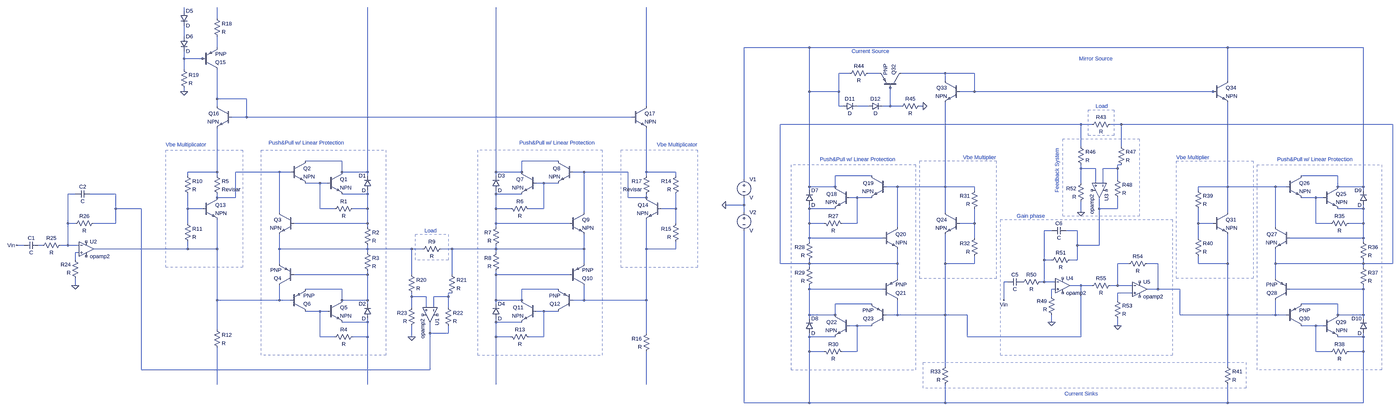
[diagram p0: schematic V1.asc, whole sheet]
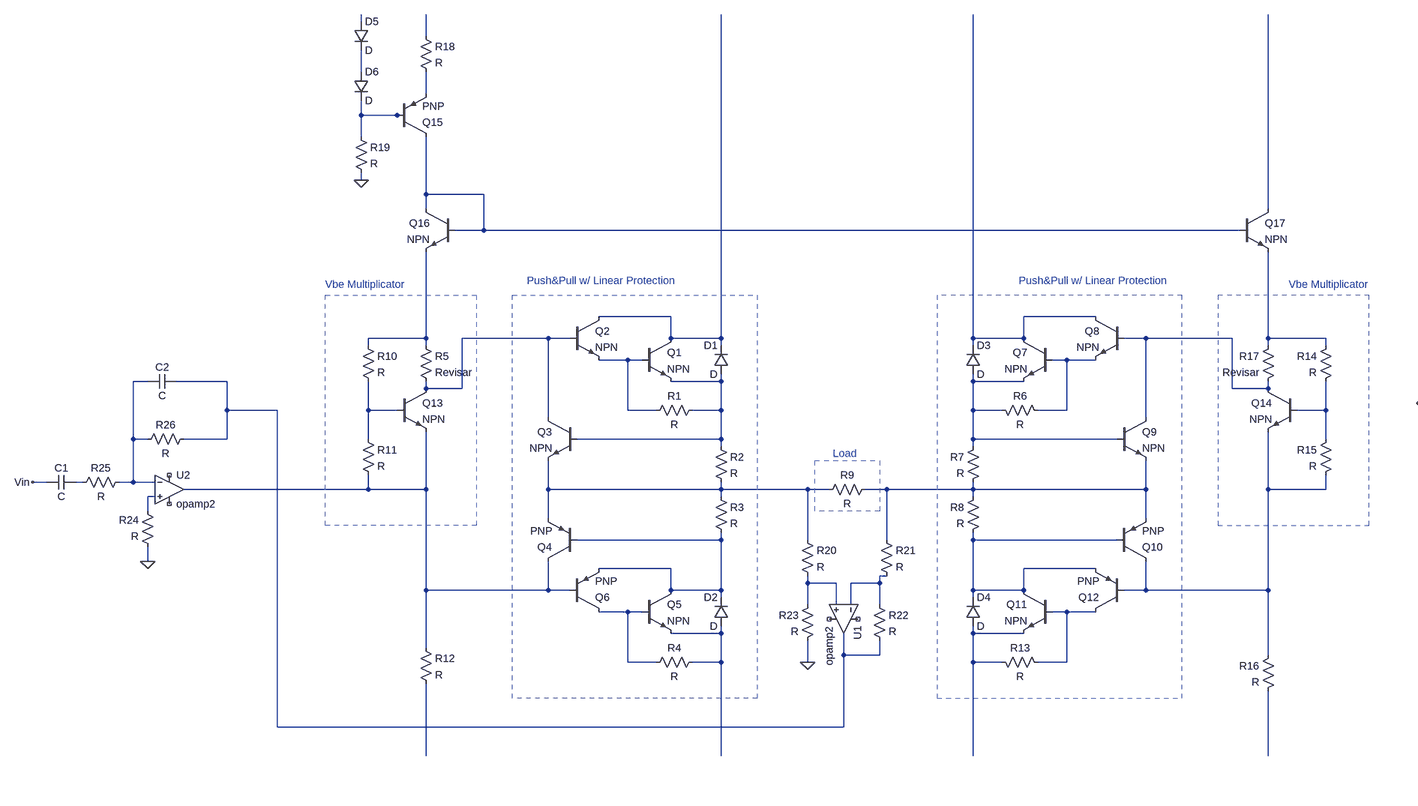
[diagram p1: schematic V1.asc, part, row 1 of 1, column 1 of 2]
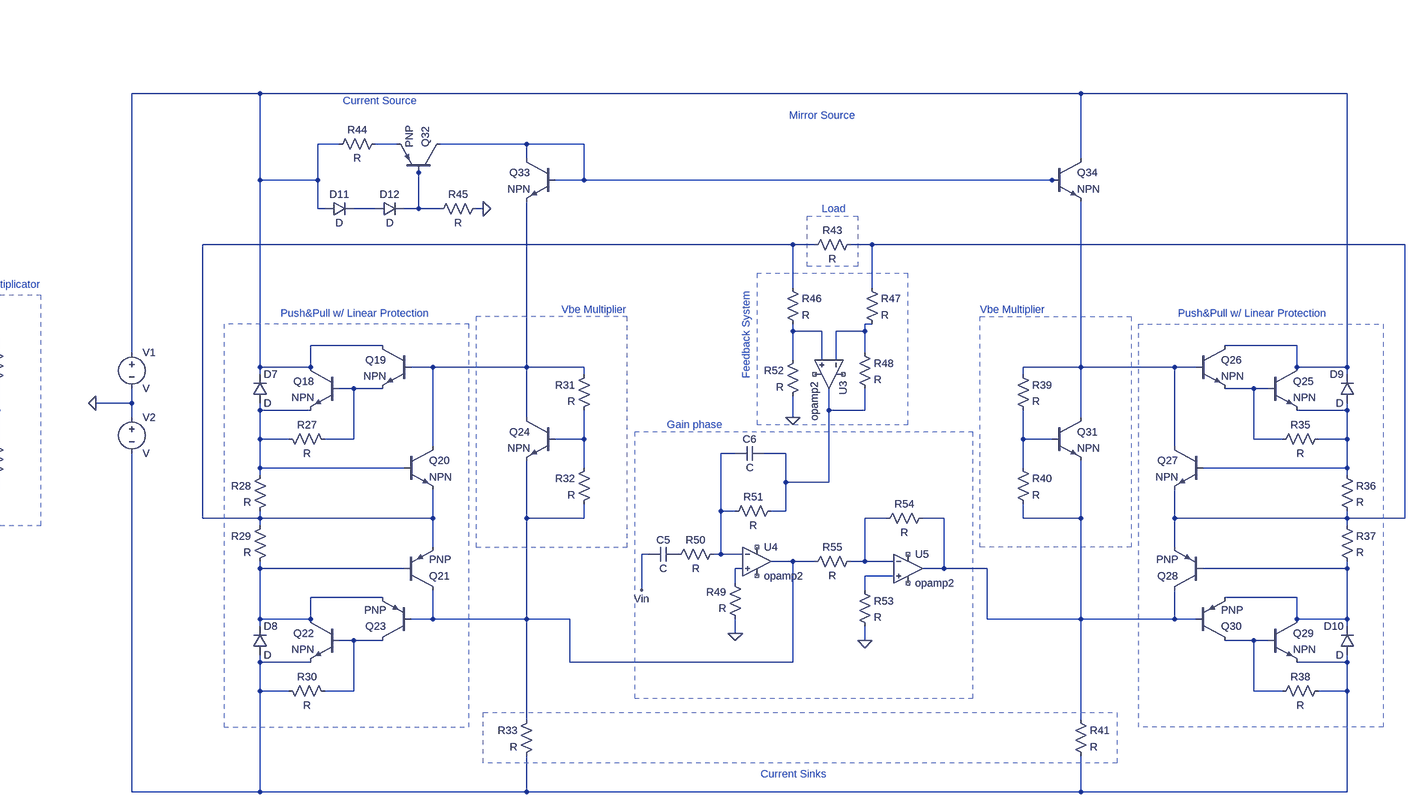
[diagram p2: schematic V1.asc, part, row 1 of 1, column 2 of 2]
V1.asc, the LTspice schematic file:
Version 4
SHEET 1 5492 2148
WIRE -528 -672 -528 -688
WIRE -384 -640 -384 -688
WIRE -528 -560 -528 -608
WIRE -384 -512 -384 -560
WIRE 2672 -512 2352 -512
WIRE 4496 -512 2672 -512
WIRE 5088 -512 4496 -512
WIRE -528 -464 -528 -496
WIRE -448 -464 -528 -464
WIRE -432 -464 -448 -464
WIRE -528 -416 -528 -464
WIRE 2848 -400 2800 -400
WIRE 2976 -400 2928 -400
WIRE 3264 -400 3072 -400
WIRE 3392 -400 3264 -400
WIRE 3264 -368 3264 -400
WIRE 4496 -368 4496 -512
WIRE 3024 -336 3024 -352
WIRE -528 -320 -528 -336
WIRE 2672 -320 2672 -512
WIRE 2800 -320 2800 -400
WIRE 2800 -320 2672 -320
WIRE 3392 -320 3392 -400
WIRE 3392 -320 3328 -320
WIRE 4432 -320 3392 -320
WIRE 4448 -320 4432 -320
WIRE -384 -288 -384 -416
WIRE -256 -288 -384 -288
WIRE -384 -256 -384 -288
WIRE 1488 -256 1488 -688
WIRE 2800 -256 2800 -320
WIRE 2816 -256 2800 -256
WIRE 2928 -256 2880 -256
WIRE 3024 -256 3024 -336
WIRE 3024 -256 2992 -256
WIRE 3072 -256 3024 -256
WIRE 3168 -256 3152 -256
WIRE -256 -208 -256 -288
WIRE -256 -208 -320 -208
WIRE 1424 -208 -256 -208
WIRE 3856 -176 2544 -176
WIRE 3904 -176 3856 -176
WIRE 4032 -176 3984 -176
WIRE 5216 -176 4032 -176
WIRE 3856 -80 3856 -176
WIRE 4032 -80 4032 -176
WIRE 160 -16 0 -16
WIRE 1104 -16 944 -16
WIRE 4032 0 4016 0
WIRE 3856 16 3856 0
WIRE 3920 16 3856 16
WIRE 4016 16 4016 0
WIRE 4016 16 3952 16
WIRE -384 32 -384 -160
WIRE -384 32 -512 32
WIRE -112 32 -304 32
WIRE -64 32 -112 32
WIRE 160 32 160 -16
WIRE 272 32 272 -688
WIRE 272 32 160 32
WIRE 832 32 832 -688
WIRE 944 32 944 -16
WIRE 944 32 832 32
WIRE 1216 32 1168 32
WIRE 1408 32 1216 32
WIRE 1488 32 1488 -160
WIRE 1616 32 1488 32
WIRE -512 48 -512 32
WIRE -384 48 -384 32
WIRE 272 48 272 32
WIRE 832 48 832 32
WIRE 1488 48 1488 32
WIRE 1616 48 1616 32
WIRE 2944 48 2784 48
WIRE 4976 48 4816 48
WIRE 2352 64 2352 -512
WIRE 4016 64 4016 16
WIRE 64 80 0 80
WIRE 96 80 64 80
WIRE 1040 80 1008 80
WIRE 1104 80 1040 80
WIRE 3856 80 3856 16
WIRE 3920 80 3920 16
WIRE 3952 80 3952 16
WIRE 2672 96 2672 -320
WIRE 2784 96 2784 48
WIRE 2784 96 2672 96
WIRE 3056 96 3008 96
WIRE 3264 96 3264 -272
WIRE 3264 96 3056 96
WIRE 3392 96 3264 96
WIRE 4496 96 4496 -272
WIRE 4496 96 4368 96
WIRE 4704 96 4496 96
WIRE 4752 96 4704 96
WIRE 4976 96 4976 48
WIRE 5088 96 5088 -512
WIRE 5088 96 4976 96
WIRE 2672 112 2672 96
WIRE 3392 112 3392 96
WIRE 4368 112 4368 96
WIRE 5088 112 5088 96
WIRE -1216 128 -1248 128
WIRE -1040 128 -1152 128
WIRE 272 128 272 112
WIRE 272 128 160 128
WIRE 832 128 832 112
WIRE 944 128 832 128
WIRE -384 144 -384 128
WIRE -304 144 -304 32
WIRE -304 144 -384 144
WIRE 1408 144 1408 32
WIRE 1488 144 1488 128
WIRE 1488 144 1408 144
WIRE 2880 144 2848 144
WIRE 2944 144 2880 144
WIRE 4880 144 4816 144
WIRE 4912 144 4880 144
WIRE 2352 176 2352 144
WIRE 2352 176 2272 176
WIRE -1040 192 -1040 128
WIRE -768 192 -1040 192
WIRE -512 192 -512 128
WIRE -448 192 -512 192
WIRE 64 192 64 80
WIRE 128 192 64 192
WIRE 272 192 272 128
WIRE 272 192 208 192
WIRE 832 192 832 128
WIRE 896 192 832 192
WIRE 1040 192 1040 80
WIRE 1040 192 976 192
WIRE 1616 192 1616 128
WIRE 1616 192 1552 192
WIRE 2672 192 2672 176
WIRE 2784 192 2672 192
WIRE 3936 192 3936 144
WIRE 4016 192 4016 144
WIRE 4016 192 3936 192
WIRE 5088 192 5088 176
WIRE 5088 192 4976 192
WIRE -112 208 -112 32
WIRE 1216 208 1216 32
WIRE 2352 208 2352 176
WIRE 3264 208 3264 96
WIRE 3856 208 3856 160
WIRE 4496 208 4496 96
WIRE -1248 256 -1248 128
WIRE -1216 256 -1248 256
WIRE -1040 256 -1040 192
WIRE -1040 256 -1136 256
WIRE -512 256 -512 192
WIRE 272 256 272 192
WIRE 272 256 -48 256
WIRE 832 256 832 192
WIRE 1152 256 832 256
WIRE 1616 256 1616 192
WIRE 2672 256 2672 192
WIRE 2736 256 2672 256
WIRE 2880 256 2880 144
WIRE 2880 256 2816 256
WIRE 3392 256 3392 192
WIRE 3392 256 3328 256
WIRE 4368 256 4368 192
WIRE 4432 256 4368 256
WIRE 4880 256 4880 144
WIRE 4944 256 4880 256
WIRE 5088 256 5088 192
WIRE 5088 256 5024 256
WIRE 272 272 272 256
WIRE 832 272 832 256
WIRE 3056 272 3056 96
WIRE 4704 272 4704 96
WIRE 3728 288 3696 288
WIRE 3840 288 3792 288
WIRE 2672 320 2672 256
WIRE 2992 320 2672 320
WIRE 3392 320 3392 256
WIRE 4368 320 4368 256
WIRE 5088 320 5088 256
WIRE 5088 320 4768 320
WIRE 2672 336 2672 320
WIRE 5088 336 5088 320
WIRE -1440 352 -1472 352
WIRE -1360 352 -1376 352
WIRE -1248 352 -1248 256
WIRE -1248 352 -1280 352
WIRE -1200 352 -1248 352
WIRE 3840 352 3840 288
WIRE 3936 352 3936 192
WIRE 3936 352 3840 352
WIRE -512 368 -512 336
WIRE -512 368 -1136 368
WIRE -384 368 -384 240
WIRE -384 368 -512 368
WIRE -112 368 -112 304
WIRE 272 368 272 352
WIRE 272 368 -112 368
WIRE 464 368 272 368
WIRE 512 368 464 368
WIRE 640 368 592 368
WIRE 832 368 832 352
WIRE 832 368 640 368
WIRE 1216 368 1216 304
WIRE 1216 368 832 368
WIRE 1488 368 1488 240
WIRE 1616 368 1616 336
WIRE 1616 368 1488 368
WIRE -1200 384 -1216 384
WIRE 272 384 272 368
WIRE 832 384 832 368
WIRE -1216 416 -1216 384
WIRE 3696 416 3696 288
WIRE 3728 416 3696 416
WIRE 3840 416 3840 352
WIRE 3840 416 3808 416
WIRE -112 432 -112 368
WIRE 1216 432 1216 368
WIRE 2544 432 2544 -176
WIRE 2672 432 2672 416
WIRE 2672 432 2544 432
WIRE 3056 432 3056 368
WIRE 3056 432 2672 432
WIRE 3264 432 3264 304
WIRE 3392 432 3392 400
WIRE 3392 432 3264 432
WIRE 4064 432 4016 432
WIRE 4192 432 4144 432
WIRE 4368 432 4368 400
WIRE 4496 432 4496 304
WIRE 4496 432 4368 432
WIRE 4704 432 4704 368
WIRE 5088 432 5088 416
WIRE 5088 432 4704 432
WIRE 5216 432 5216 -176
WIRE 5216 432 5088 432
WIRE 2672 448 2672 432
WIRE 5088 448 5088 432
WIRE 272 480 272 464
WIRE 272 480 -48 480
WIRE 464 480 464 368
WIRE 640 480 640 368
WIRE 832 480 832 464
WIRE 1152 480 832 480
WIRE 3056 496 3056 432
WIRE 4704 496 4704 432
WIRE 3536 512 3520 512
WIRE 3696 512 3696 416
WIRE 3696 512 3680 512
WIRE 3744 512 3696 512
WIRE -1216 528 -1216 496
WIRE 3856 528 3808 528
WIRE 3904 528 3856 528
WIRE 4016 528 4016 432
WIRE 4016 528 3984 528
WIRE 4080 528 4016 528
WIRE 160 544 0 544
WIRE 1104 544 944 544
WIRE 2672 544 2672 528
WIRE 2992 544 2672 544
WIRE 3744 544 3728 544
WIRE 4192 544 4192 432
WIRE 4192 544 4144 544
WIRE 4288 544 4192 544
WIRE 5088 544 5088 528
WIRE 5088 544 4768 544
WIRE 640 560 624 560
WIRE 4080 560 4016 560
WIRE 464 576 464 560
WIRE 528 576 464 576
WIRE 624 576 624 560
WIRE 624 576 560 576
WIRE 3728 576 3728 544
WIRE -384 592 -384 368
WIRE -112 592 -112 528
WIRE -112 592 -384 592
WIRE -64 592 -112 592
WIRE 160 592 160 544
WIRE 272 592 272 480
WIRE 272 592 160 592
WIRE 832 592 832 480
WIRE 944 592 944 544
WIRE 944 592 832 592
WIRE 1216 592 1216 528
WIRE 1216 592 1168 592
WIRE 1488 592 1488 368
WIRE 1488 592 1216 592
WIRE 3520 592 3520 512
WIRE 4016 592 4016 560
WIRE 272 608 272 592
WIRE 832 608 832 592
WIRE 2944 608 2784 608
WIRE 4976 608 4816 608
WIRE 464 624 464 576
WIRE 528 624 528 576
WIRE 560 624 560 576
WIRE 624 624 624 576
WIRE 64 640 0 640
WIRE 96 640 64 640
WIRE 1040 640 1008 640
WIRE 1104 640 1040 640
WIRE 2672 656 2672 544
WIRE 2784 656 2784 608
WIRE 2784 656 2672 656
WIRE 3056 656 3056 592
WIRE 3056 656 3008 656
WIRE 3264 656 3264 432
WIRE 3264 656 3056 656
WIRE 3360 656 3264 656
WIRE 4288 656 4288 544
WIRE 4496 656 4496 432
WIRE 4496 656 4288 656
WIRE 4704 656 4704 592
WIRE 4704 656 4496 656
WIRE 4752 656 4704 656
WIRE 4976 656 4976 608
WIRE 5088 656 5088 544
WIRE 5088 656 4976 656
WIRE 2672 672 2672 656
WIRE 5088 672 5088 656
WIRE 272 688 272 672
WIRE 272 688 160 688
WIRE 832 688 832 672
WIRE 944 688 832 688
WIRE 3728 688 3728 656
WIRE 2880 704 2848 704
WIRE 2944 704 2880 704
WIRE 4016 704 4016 672
WIRE 4880 704 4816 704
WIRE 4912 704 4880 704
WIRE -384 720 -384 592
WIRE 544 736 544 688
WIRE 624 736 624 704
WIRE 624 736 544 736
WIRE 1488 736 1488 592
WIRE 64 752 64 640
WIRE 128 752 64 752
WIRE 272 752 272 688
WIRE 272 752 208 752
WIRE 464 752 464 704
WIRE 832 752 832 688
WIRE 896 752 832 752
WIRE 1040 752 1040 640
WIRE 1040 752 976 752
WIRE 2672 752 2672 736
WIRE 2784 752 2672 752
WIRE 3360 752 3360 656
WIRE 3856 752 3856 528
WIRE 3856 752 3360 752
WIRE 5088 752 5088 736
WIRE 5088 752 4976 752
WIRE 2672 816 2672 752
WIRE 2736 816 2672 816
WIRE 2880 816 2880 704
WIRE 2880 816 2816 816
WIRE 4880 816 4880 704
WIRE 4944 816 4880 816
WIRE 5088 816 5088 752
WIRE 5088 816 5024 816
WIRE 3264 880 3264 656
WIRE 4496 880 4496 656
WIRE -768 896 -768 192
WIRE 544 896 544 736
WIRE 544 896 -768 896
WIRE -384 960 -384 800
WIRE 272 960 272 752
WIRE 832 960 832 752
WIRE 1488 960 1488 816
WIRE 2352 1040 2352 288
WIRE 2672 1040 2672 816
WIRE 2672 1040 2352 1040
WIRE 3264 1040 3264 960
WIRE 3264 1040 2672 1040
WIRE 4496 1040 4496 960
WIRE 4496 1040 3264 1040
WIRE 5088 1040 5088 816
WIRE 5088 1040 4496 1040
FLAG -528 -320 0
FLAG 464 752 0
FLAG -1216 528 0
FLAG -1472 352 Vin
FLAG 3168 -256 0
FLAG 3728 688 0
FLAG 3520 592 Vin
FLAG 3856 208 0
FLAG 4016 704 0
FLAG 2272 176 0
SYMBOL npn 96 32 R0
SYMATTR InstName Q1
SYMBOL npn -64 -16 R0
SYMATTR InstName Q2
SYMBOL diode 288 112 R180
WINDOW 0 24 64 Left 2
WINDOW 3 24 0 Left 2
SYMATTR InstName D1
SYMBOL res 224 176 R90
WINDOW 0 0 56 VBottom 2
WINDOW 3 32 56 VTop 2
SYMATTR InstName R1
SYMBOL npn -48 208 M0
SYMATTR InstName Q3
SYMBOL res 256 256 R0
SYMATTR InstName R2
SYMBOL res 256 368 R0
SYMATTR InstName R3
SYMBOL pnp -48 528 R180
SYMATTR InstName Q4
SYMBOL npn 96 592 R0
SYMATTR InstName Q5
SYMBOL diode 288 672 R180
WINDOW 0 24 64 Left 2
WINDOW 3 24 0 Left 2
SYMATTR InstName D2
SYMBOL res 224 736 R90
WINDOW 0 0 56 VBottom 2
WINDOW 3 32 56 VTop 2
SYMATTR InstName R4
SYMBOL pnp -64 640 M180
SYMATTR InstName Q6
SYMBOL res 608 352 R90
WINDOW 0 0 56 VBottom 2
WINDOW 3 32 56 VTop 2
SYMATTR InstName R9
SYMBOL npn -448 144 R0
SYMATTR InstName Q13
SYMBOL res -528 32 R0
SYMATTR InstName R10
SYMBOL res -528 240 R0
SYMATTR InstName R11
SYMBOL res -400 704 R0
SYMATTR InstName R12
SYMBOL res -400 32 R0
SYMATTR InstName R5
SYMATTR Value Revisar
SYMBOL npn 1008 32 M0
SYMATTR InstName Q7
SYMBOL npn 1168 -16 M0
SYMATTR InstName Q8
SYMBOL diode 816 112 M180
WINDOW 0 24 64 Left 2
WINDOW 3 24 0 Left 2
SYMATTR InstName D3
SYMBOL res 880 176 M90
WINDOW 0 0 56 VBottom 2
WINDOW 3 32 56 VTop 2
SYMATTR InstName R6
SYMBOL npn 1152 208 R0
SYMATTR InstName Q9
SYMBOL res 848 256 M0
SYMATTR InstName R7
SYMBOL res 848 368 M0
SYMATTR InstName R8
SYMBOL pnp 1152 528 M180
SYMATTR InstName Q10
SYMBOL npn 1008 592 M0
SYMATTR InstName Q11
SYMBOL diode 816 672 M180
WINDOW 0 24 64 Left 2
WINDOW 3 24 0 Left 2
SYMATTR InstName D4
SYMBOL res 880 736 M90
WINDOW 0 0 56 VBottom 2
WINDOW 3 32 56 VTop 2
SYMATTR InstName R13
SYMBOL pnp 1168 640 R180
SYMATTR InstName Q12
SYMBOL npn 1552 144 M0
SYMATTR InstName Q14
SYMBOL res 1632 32 M0
SYMATTR InstName R14
SYMBOL res 1632 240 M0
SYMATTR InstName R15
SYMBOL res 1504 720 M0
SYMATTR InstName R16
SYMBOL res 1504 32 M0
SYMATTR InstName R17
SYMATTR Value Revisar
SYMBOL pnp -448 -416 M180
SYMATTR InstName Q15
SYMBOL res -400 -656 R0
SYMATTR InstName R18
SYMBOL res -544 -432 R0
SYMATTR InstName R19
SYMBOL diode -544 -672 R0
SYMATTR InstName D5
SYMBOL diode -544 -560 R0
SYMATTR InstName D6
SYMBOL npn -320 -256 M0
SYMATTR InstName Q16
SYMBOL npn 1424 -256 R0
SYMATTR InstName Q17
SYMBOL Opamps\\opamp2 608 656 R90
SYMATTR InstName U1
SYMBOL res 448 464 R0
SYMATTR InstName R20
SYMBOL res 624 464 R0
SYMATTR InstName R21
SYMBOL res 608 608 R0
SYMATTR InstName R22
SYMBOL res 480 608 M0
SYMATTR InstName R23
SYMBOL Opamps\\opamp2 -1168 304 R0
SYMATTR InstName U2
SYMBOL res -1200 512 R180
WINDOW 0 36 76 Left 2
WINDOW 3 36 40 Left 2
SYMATTR InstName R24
SYMBOL res -1264 336 R90
WINDOW 0 0 56 VBottom 2
WINDOW 3 32 56 VTop 2
SYMATTR InstName R25
SYMBOL cap -1376 336 R90
WINDOW 0 0 32 VBottom 2
WINDOW 3 32 32 VTop 2
SYMATTR InstName C1
SYMBOL res -1120 240 R90
WINDOW 0 0 56 VBottom 2
WINDOW 3 32 56 VTop 2
SYMATTR InstName R26
SYMBOL cap -1152 112 R90
WINDOW 0 0 32 VBottom 2
WINDOW 3 32 32 VTop 2
SYMATTR InstName C2
SYMBOL npn 2848 96 M0
SYMATTR InstName Q18
SYMBOL npn 3008 48 M0
SYMATTR InstName Q19
SYMBOL diode 2656 176 M180
WINDOW 0 24 64 Left 2
WINDOW 3 24 0 Left 2
SYMATTR InstName D7
SYMBOL res 2720 240 M90
WINDOW 0 0 56 VBottom 2
WINDOW 3 32 56 VTop 2
SYMATTR InstName R27
SYMBOL npn 2992 272 R0
SYMATTR InstName Q20
SYMBOL res 2688 320 M0
SYMATTR InstName R28
SYMBOL res 2688 432 M0
SYMATTR InstName R29
SYMBOL pnp 2992 592 M180
SYMATTR InstName Q21
SYMBOL npn 2848 656 M0
SYMATTR InstName Q22
SYMBOL diode 2656 736 M180
WINDOW 0 24 64 Left 2
WINDOW 3 24 0 Left 2
SYMATTR InstName D8
SYMBOL res 2720 800 M90
WINDOW 0 0 56 VBottom 2
WINDOW 3 32 56 VTop 2
SYMATTR InstName R30
SYMBOL pnp 3008 704 R180
SYMATTR InstName Q23
SYMBOL npn 3328 208 M0
SYMATTR InstName Q24
SYMBOL res 3408 96 M0
SYMATTR InstName R31
SYMBOL res 3408 304 M0
SYMATTR InstName R32
SYMBOL res 3280 864 M0
SYMATTR InstName R33
SYMBOL npn 4912 96 R0
SYMATTR InstName Q25
SYMBOL npn 4752 48 R0
SYMATTR InstName Q26
SYMBOL diode 5104 176 R180
WINDOW 0 24 64 Left 2
WINDOW 3 24 0 Left 2
SYMATTR InstName D9
SYMBOL res 5040 240 R90
WINDOW 0 0 56 VBottom 2
WINDOW 3 32 56 VTop 2
SYMATTR InstName R35
SYMBOL npn 4768 272 M0
SYMATTR InstName Q27
SYMBOL res 5072 320 R0
SYMATTR InstName R36
SYMBOL res 5072 432 R0
SYMATTR InstName R37
SYMBOL pnp 4768 592 R180
SYMATTR InstName Q28
SYMBOL npn 4912 656 R0
SYMATTR InstName Q29
SYMBOL diode 5104 736 R180
WINDOW 0 24 64 Left 2
WINDOW 3 24 0 Left 2
SYMATTR InstName D10
SYMBOL res 5040 800 R90
WINDOW 0 0 56 VBottom 2
WINDOW 3 32 56 VTop 2
SYMATTR InstName R38
SYMBOL pnp 4752 704 M180
SYMATTR InstName Q30
SYMBOL npn 4432 208 R0
SYMATTR InstName Q31
SYMBOL res 4352 96 R0
SYMATTR InstName R39
SYMBOL res 4352 304 R0
SYMATTR InstName R40
SYMBOL res 4480 864 R0
SYMATTR InstName R41
SYMBOL res 4000 -192 R90
WINDOW 0 0 56 VBottom 2
WINDOW 3 32 56 VTop 2
SYMATTR InstName R43
SYMBOL pnp 3072 -336 M270
SYMATTR InstName Q32
SYMBOL res 2832 -384 R270
WINDOW 0 32 56 VTop 2
WINDOW 3 0 56 VBottom 2
SYMATTR InstName R44
SYMBOL res 3056 -240 R270
WINDOW 0 32 56 VTop 2
WINDOW 3 0 56 VBottom 2
SYMATTR InstName R45
SYMBOL diode 2816 -240 R270
WINDOW 0 32 32 VTop 2
WINDOW 3 0 32 VBottom 2
SYMATTR InstName D11
SYMBOL diode 2928 -240 R270
WINDOW 0 32 32 VTop 2
WINDOW 3 0 32 VBottom 2
SYMATTR InstName D12
SYMBOL npn 3328 -368 M0
SYMATTR InstName Q33
SYMBOL npn 4432 -368 R0
SYMATTR InstName Q34
SYMBOL Opamps\\opamp2 3776 464 R0
SYMATTR InstName U4
SYMBOL res 3744 672 R180
WINDOW 0 36 76 Left 2
WINDOW 3 36 40 Left 2
SYMATTR InstName R49
SYMBOL res 3696 496 R90
WINDOW 0 0 56 VBottom 2
WINDOW 3 32 56 VTop 2
SYMATTR InstName R50
SYMBOL cap 3600 496 R90
WINDOW 0 0 32 VBottom 2
WINDOW 3 32 32 VTop 2
SYMATTR InstName C5
SYMBOL res 3824 400 R90
WINDOW 0 0 56 VBottom 2
WINDOW 3 32 56 VTop 2
SYMATTR InstName R51
SYMBOL cap 3792 272 R90
WINDOW 0 0 32 VBottom 2
WINDOW 3 32 32 VTop 2
SYMATTR InstName C6
SYMBOL Opamps\\opamp2 4000 112 R90
SYMATTR InstName U3
SYMBOL res 3840 -96 R0
SYMATTR InstName R46
SYMBOL res 4016 -96 R0
SYMATTR InstName R47
SYMBOL res 4000 48 R0
SYMATTR InstName R48
SYMBOL res 3872 64 M0
SYMATTR InstName R52
SYMBOL Opamps\\opamp2 4112 480 R0
SYMATTR InstName U5
SYMBOL res 4000 576 R0
SYMATTR InstName R53
SYMBOL res 4160 416 R90
WINDOW 0 0 56 VBottom 2
WINDOW 3 32 56 VTop 2
SYMATTR InstName R54
SYMBOL res 4000 512 R90
WINDOW 0 0 56 VBottom 2
WINDOW 3 32 56 VTop 2
SYMATTR InstName R55
SYMBOL voltage 2352 48 R0
SYMATTR InstName V1
SYMBOL voltage 2352 192 R0
SYMATTR InstName V2
TEXT -160 -96 Left 2 ;Push&Pull w/ Linear Protection
TEXT -608 -88 Left 2 ;Vbe Multiplicator
TEXT 520 288 Left 2 ;Load
TEXT 1264 -96 Right 2 ;Push&Pull w/ Linear Protection
TEXT 1712 -88 Right 2 ;Vbe Multiplicator
TEXT 3048 -24 Right 2 ;Push&Pull w/ Linear Protection
TEXT 3488 -32 Right 2 ;Vbe Multiplier
TEXT 4712 -24 Left 2 ;Push&Pull w/ Linear Protection
TEXT 4272 -32 Left 2 ;Vbe Multiplier
TEXT 3576 224 Left 2 ;Gain phase
TEXT 3752 -72 VRight 2 ;Feedback System
TEXT 3920 -256 Left 2 ;Load
TEXT 2856 -496 Left 2 ;Current Source
TEXT 3848 -464 Left 2 ;Mirror Source
TEXT 3784 1000 Left 2 ;Current Sinks
RECTANGLE Normal -272 448 -608 -64 2
RECTANGLE Normal 352 832 -192 -64 2
RECTANGLE Normal 1376 448 1712 -64 2
RECTANGLE Normal 752 832 1296 -64 2
RECTANGLE Normal 624 416 480 304 2
RECTANGLE Normal 3152 496 3488 -16 2
RECTANGLE Normal 2592 896 3136 0 2
RECTANGLE Normal 4608 496 4272 -16 2
RECTANGLE Normal 5168 896 4624 0 2
RECTANGLE Normal 4256 240 3504 832 2
RECTANGLE Normal 4112 -112 3776 224 2
RECTANGLE Normal 4000 -128 3888 -240 2
RECTANGLE Normal 4576 976 3168 864 2

The netlist it stands for:
* V1.asc
Q1 N015 N023 N029 0 NPN
Q2 N015 N020 N023 0 NPN
D1 N029 N015 D
R1 N029 N023 R
Q3 N020 N029 N043 0 NPN
R2 N029 N043 R
R3 N043 N050 R
Q4 N042 N050 N043 0 PNP
Q5 N050 N058 N060 0 NPN
D2 N060 N050 D
R4 N060 N058 R
Q6 N058 N042 N050 0 PNP
R9 N044 N043 R
Q13 N020 N033 N042 0 NPN
R10 N019 N033 R
R11 N033 N042 R
R12 N042 N065 R
R5 N019 N020 Revisar
Q7 N016 N024 N030 0 NPN
Q8 N016 N021 N024 0 NPN
D3 N030 N016 D
R6 N030 N024 R
Q9 N021 N030 N044 0 NPN
R7 N030 N044 R
R8 N044 N051 R
Q10 N045 N051 N044 0 PNP
Q11 N051 N059 N061 0 NPN
D4 N061 N051 D
R13 N061 N059 R
Q12 N059 N045 N051 0 PNP
Q14 N021 N034 N045 0 NPN
R14 N022 N034 R
R15 N034 N045 R
R16 N045 N066 R
R17 N022 N021 Revisar
Q15 N010 N006 N004 0 PNP
R18 N002 N004 R
R19 N006 0 R
D5 N001 N003 D
D6 N003 N006 D
Q16 N010 N010 N019 0 NPN
Q17 N011 N010 N022 0 NPN
XU1 N057 N055 NC_01 NC_02 N028 opamp2  ; pins In+ In- V+ V- OUT
R20 N043 N057 R
R21 N044 N055 R
R22 N055 N028 R
R23 N057 0 R
XU2 N046 N027 NC_03 NC_04 N042 opamp2  ; pins In+ In- V+ V- OUT
R24 0 N046 R
R25 N027 N041 R
C1 N041 Vin C
R26 N028 N027 R
C2 N028 N027 C
Q18 N005 N031 N035 0 NPN
Q19 N005 N025 N031 0 NPN
D7 N035 N005 D
R27 N035 N031 R
Q20 N025 N035 N013 0 NPN
R28 N035 N013 R
R29 N013 N052 R
Q21 N047 N052 N013 0 PNP
Q22 N052 N062 N064 0 NPN
D8 N064 N052 D
R30 N064 N062 R
Q23 N062 N047 N052 0 PNP
Q24 N025 N038 N047 0 NPN
R31 N025 N038 R
R32 N038 N047 R
R33 N047 N064 R
Q25 N005 N032 N037 0 NPN
Q26 N005 N026 N032 0 NPN
D9 N037 N005 D
R35 N037 N032 R
Q27 N026 N037 N014 0 NPN
R36 N037 N014 R
R37 N014 N054 R
Q28 N049 N054 N014 0 PNP
Q29 N054 N063 N064 0 NPN
D10 N064 N054 D
R38 N064 N063 R
Q30 N063 N049 N054 0 PNP
Q31 N026 N039 N049 0 NPN
R39 N026 N039 R
R40 N039 N049 R
R41 N049 N064 R
R43 N014 N013 R
Q32 N008 N009 N007 0 PNP
R44 N005 N007 R
R45 N009 0 R
D11 N005 N012 D
D12 N012 N009 D
Q33 N008 N008 N025 0 NPN
Q34 N005 N008 N026 0 NPN
XU4 N053 N040 NC_05 NC_06 N047 opamp2  ; pins In+ In- V+ V- OUT
R49 0 N053 R
R50 N040 P001 R
C5 P001 Vin C
R51 N036 N040 R
C6 N036 N040 C
XU3 N018 N017 NC_07 NC_08 N036 opamp2  ; pins In+ In- V+ V- OUT
R46 N013 N018 R
R47 N014 N017 R
R48 N017 N036 R
R52 N018 0 R
XU5 N056 N048 NC_09 NC_10 N049 opamp2  ; pins In+ In- V+ V- OUT
R53 N056 0 R
R54 N049 N048 R
R55 N048 N047 R
V1 N005 0 V
V2 0 N064 V
.model D D
.lib standard.dio
.model NPN NPN
.model PNP PNP
.lib standard.bjt
* Push&Pull w/ Linear Protection
* Vbe Multiplicator
* Load
* Push&Pull w/ Linear Protection
* Vbe Multiplicator
* Push&Pull w/ Linear Protection
* Vbe Multiplier
* Push&Pull w/ Linear Protection
* Vbe Multiplier
* Gain phase
* Feedback System
* Load
* Current Source
* Mirror Source
* Current Sinks
.backanno
.end